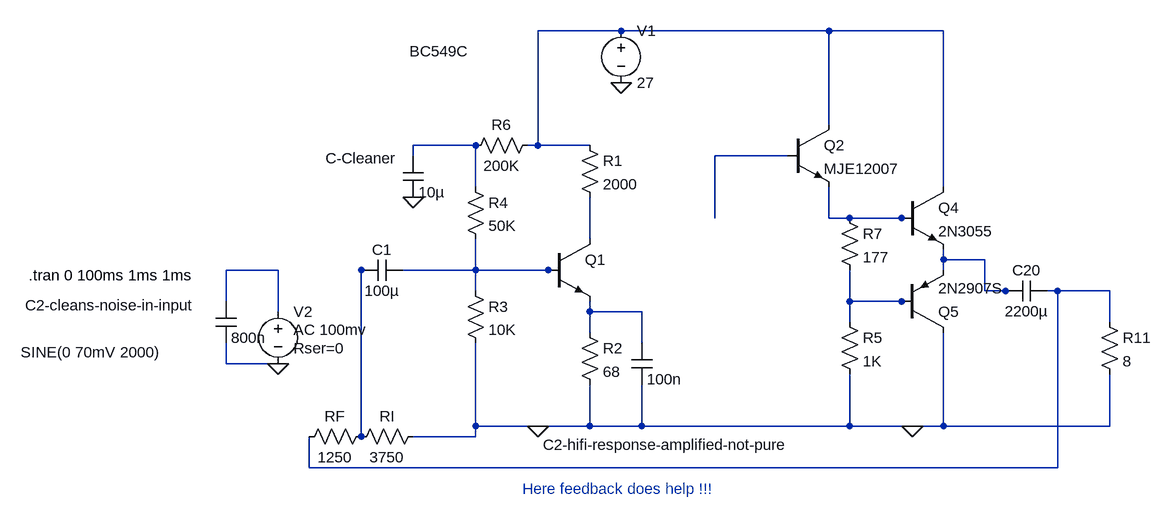
[diagram p0: schematic PSU R and C with Increased IN Z -Works well  25V  actual values - Push pull with MJE3055.asc]
PSU R and C with Increased IN Z -Works well  25V  actual values - Push pull with MJE3055.asc, the LTspice schematic file:
Version 4
SHEET 1 1788 680
WIRE 272 -256 144 -256
WIRE 592 -256 272 -256
WIRE 768 -256 592 -256
WIRE 592 -112 592 -256
WIRE 48 -80 -48 -80
WIRE 144 -80 144 -256
WIRE 144 -80 128 -80
WIRE 224 -80 144 -80
WIRE -48 -64 -48 -80
WIRE 528 -64 416 -64
WIRE 48 -16 48 -80
WIRE 768 -16 768 -256
WIRE 224 64 224 0
WIRE 416 32 416 -64
WIRE 592 32 592 -16
WIRE 624 32 592 32
WIRE 704 32 624 32
WIRE 720 32 704 32
WIRE 768 96 768 80
WIRE 832 96 768 96
WIRE -256 112 -336 112
WIRE -112 112 -128 112
WIRE 48 112 48 64
WIRE 48 112 -64 112
WIRE 160 112 48 112
WIRE 176 112 160 112
WIRE 768 112 768 96
WIRE 48 144 48 112
WIRE 832 144 832 96
WIRE 864 144 832 144
WIRE 880 144 864 144
WIRE 944 144 928 144
WIRE 1024 144 944 144
WIRE -336 160 -336 112
WIRE 624 160 624 112
WIRE 704 160 624 160
WIRE 720 160 704 160
WIRE -256 176 -256 112
WIRE 224 176 224 160
WIRE 304 176 224 176
WIRE 624 192 624 160
WIRE 1024 192 1024 144
WIRE 224 208 224 176
WIRE 304 224 304 176
WIRE -336 256 -336 224
WIRE -256 256 -336 256
WIRE 48 352 48 224
WIRE 144 352 48 352
WIRE 224 352 224 288
WIRE 224 352 144 352
WIRE 304 352 304 288
WIRE 304 352 224 352
WIRE 624 352 624 272
WIRE 624 352 304 352
WIRE 720 352 624 352
WIRE 768 352 768 208
WIRE 768 352 720 352
WIRE 1024 352 1024 272
WIRE 1024 352 768 352
WIRE -128 368 -128 112
WIRE 48 368 48 352
WIRE 48 368 -48 368
WIRE -208 416 -208 368
WIRE 944 416 944 144
WIRE 944 416 -208 416
FLAG 272 -176 0
FLAG 144 352 0
FLAG -256 256 0
FLAG 720 352 0
FLAG -48 0 0
SYMBOL npn 160 64 R0
WINDOW 3 -214 -289 Left 2
SYMATTR Value BC549C
SYMATTR InstName Q1
SYMBOL res 208 -96 R0
SYMATTR InstName R1
SYMATTR Value 2000
SYMBOL voltage 272 -272 R0
WINDOW 123 0 0 Left 2
WINDOW 39 0 0 Left 2
SYMATTR InstName V1
SYMATTR Value 27
SYMBOL res 32 -32 R0
SYMATTR InstName R4
SYMATTR Value 50K
SYMBOL res 32 128 R0
SYMATTR InstName R3
SYMATTR Value 10K
SYMBOL res 208 192 R0
SYMATTR InstName R2
SYMATTR Value 68
SYMBOL cap -64 96 R90
WINDOW 0 0 32 VBottom 2
WINDOW 3 32 32 VTop 2
SYMATTR InstName C1
SYMATTR Value 100µ
SYMBOL voltage -256 160 R0
WINDOW 123 24 44 Left 2
WINDOW 39 24 72 Left 2
WINDOW 3 -396 78 Left 2
SYMATTR Value2 AC 100mv
SYMATTR SpiceLine Rser=0
SYMATTR Value SINE(0 70mV 2000)
SYMATTR InstName V2
SYMBOL res -112 352 R90
WINDOW 0 0 56 VBottom 2
WINDOW 3 32 56 VTop 2
SYMATTR InstName RF
SYMATTR Value 1250
SYMBOL res -32 352 R90
WINDOW 0 0 56 VBottom 2
WINDOW 3 32 56 VTop 2
SYMATTR InstName RI
SYMATTR Value 3750
SYMBOL npn2 704 -16 R0
SYMATTR InstName Q4
SYMATTR Value 2N3055
SYMBOL res 1008 176 R0
SYMATTR InstName R11
SYMATTR Value 8
SYMBOL pnp 704 208 M180
SYMATTR InstName Q5
SYMATTR Value 2N2907S
SYMBOL cap 928 128 R90
WINDOW 0 0 32 VBottom 2
WINDOW 3 32 32 VTop 2
SYMATTR InstName C20
SYMATTR Value 2200µ
SYMBOL res 608 176 R0
SYMATTR InstName R5
SYMATTR Value 1K
SYMBOL res 608 16 R0
SYMATTR InstName R7
SYMATTR Value 177
SYMBOL cap -64 -64 R0
WINDOW 0 -119 4 Left 2
SYMATTR InstName C-Cleaner
SYMATTR Value 10µ
SYMBOL npn 528 -112 R0
SYMATTR InstName Q2
SYMATTR Value MJE12007
SYMBOL cap 288 224 R0
WINDOW 0 -136 157 Left 2
SYMATTR InstName C2-hifi-response-amplified-not-pure
SYMATTR Value 100n
SYMBOL cap -352 160 R0
WINDOW 0 -293 6 Left 2
SYMATTR InstName C2-cleans-noise-in-input
SYMATTR Value 800n
SYMBOL res 144 -96 R90
WINDOW 0 0 56 VBottom 2
WINDOW 3 32 56 VTop 2
SYMATTR InstName R6
SYMATTR Value 200K
TEXT -640 120 Left 2 !.tran 0 100ms 1ms 1ms
TEXT 120 448 Left 2 ;Here feedback does help !!!

The netlist it stands for:
* PSU R and C with Increased IN Z -Works well  25V  actual values - Push pull with MJE3055.asc
Q1 N004 N009 N012 0 BC549C
R1 N001 N004 2000
V1 N001 0 27
R4 N002 N009 50K
R3 N009 0 10K
R2 N012 0 68
C1 N009 N008 100µ
V2 N007 0 SINE(0 70mV 2000) AC 100mv Rser=0
RF N008 N010 1250
RI 0 N008 3750
Q4 N001 N005 N006 0 2N3055
R11 N010 0 8
Q5 0 N011 N006 0 2N2907S
C20 N010 N006 2200µ
R5 N011 0 1K
R7 N005 N011 177
C-Cleaner N002 0 10µ
Q2 N001 N003 N005 0 MJE12007
C2-hifi-response-amplified-not-pure N012 0 100n
C2-cleans-noise-in-input N007 0 800n
R6 N001 N002 200K
.model NPN NPN
.model PNP PNP
.lib standard.bjt
.tran 0 100ms 1ms 1ms
* Here feedback does help !!!
.backanno
.end